# EAGLE schematic BeagleQ-v02 (EAGLE 6.4)
BOARD_NUMBER: 1.0
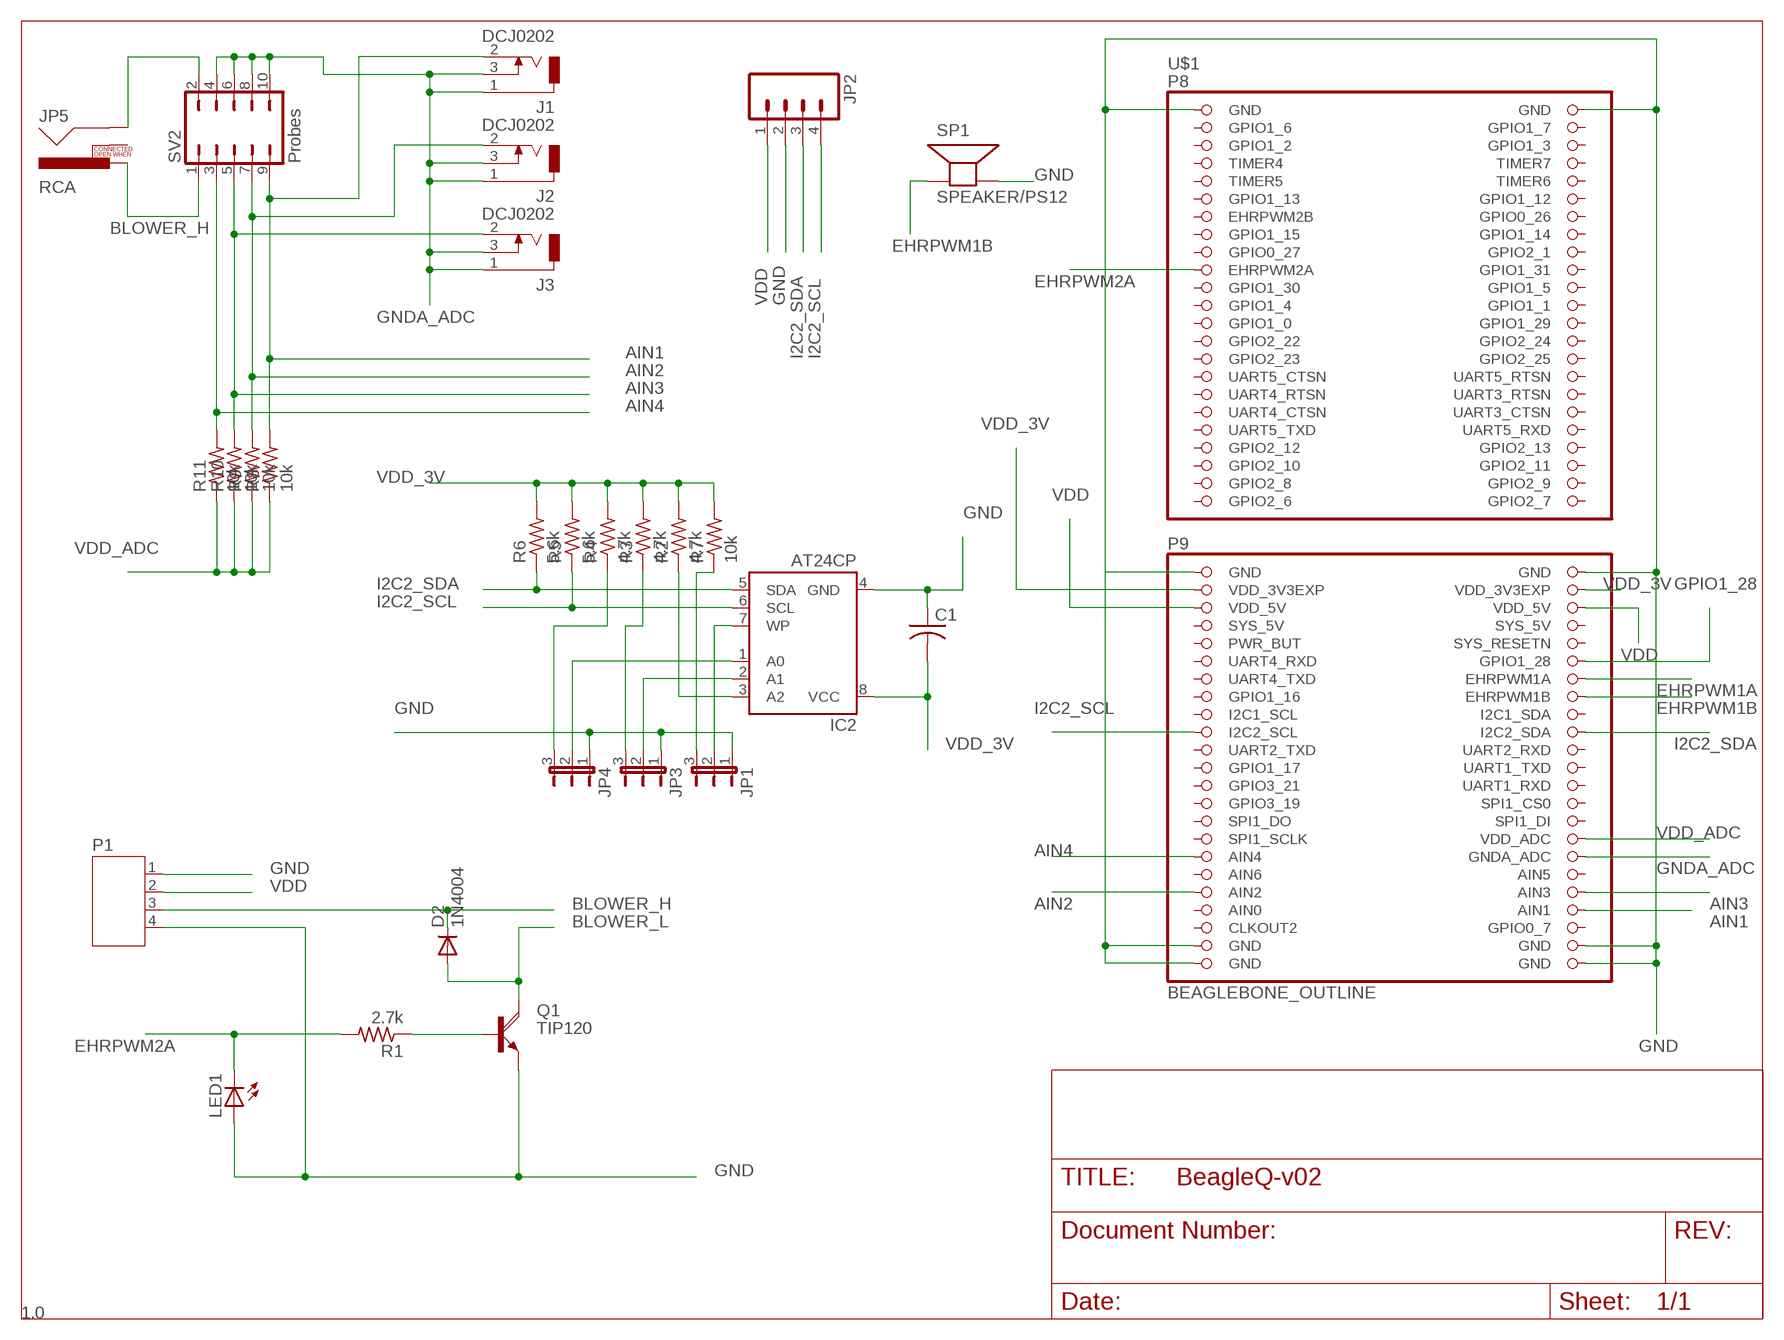
[diagram p0: schematic, sheet 1]
FRAME1 (LETTER_L): BOARD_NUMBER: 1.0

## Parts
C1  C-US025-025X050  [C025-025X050]
D2  1N4004  [DO41-10]
IC2  AT24CP  [DIL08]
J1  DCJ0202  [DCJ0202]
J2  DCJ0202  [DCJ0202]
J3  DCJ0202  [DCJ0202]
JP1  JP2E  [JP2]
JP2  M04PTH  [1X04]
JP3  JP2E  [JP2]
JP4  JP2E  [JP2]
JP5  RCA  [RCA]
LED1  LED3MM  [LED3MM]
P1  JST-PH4  [JST-PH4]
Q1  TIP120  [TO220AH]
R1  2.7k  R-US_0207/10  [0207/10]
R2  4.7k  R-US_0207/10  [0207/10]
R3  4.7k  R-US_0207/10  [0207/10]
R4  4.7k  R-US_0207/10  [0207/10]
R5  5.6k  R-US_0207/10  [0207/10]
R6  5.6k  R-US_0207/10  [0207/10]
R7  10k  R-US_0207/10  [0207/10]
R8  10k  R-US_0207/10  [0207/10]
R9  10k  R-US_0207/10  [0207/10]
R10  10k  R-US_0207/10  [0207/10]
R11  10k  R-US_0207/10  [0207/10]
SP1  SPEAKER/PS12  [PS12]
SV2  Probes  JP5Q  [JP5Q]
U$1  BEAGLEBONE_OUTLINE  [BEAGLEBONE_SHIELD]

## Nets
AIN1: J1.2 R8.2 SV2.9 U$1.86(AIN1)
AIN2: J2.2 R9.2 SV2.7 U$1.83(AIN2)
AIN3: J3.2 R10.2 SV2.5 U$1.84(AIN3)
AIN4: R11.2 SV2.3 U$1.79(AIN4)
BLOWER_H: D2.C JP5.PIN P1.3 SV2.1
BLOWER_L: D2.A JP5.SHELL Q1.C SV2.2
EHRPWM1A: U$1.60(EHRPWM1A)
EHRPWM1B: SP1.P$1(+) U$1.62(EHRPWM1B)
EHRPWM2A: LED1.K(C) R1.2 U$1.19(EHRPWM2A)
GND: C1.1 IC2.4(GND) JP1.1 JP2.2 JP3.1 JP4.1 LED1.A P1.1 P1.4 Q1.E SP1.P$2(-) U$1.1(GND) U$1.2(GND) U$1.47(GND) U$1.48(GND) U$1.89(GND) U$1.90(GND) U$1.91(GND) U$1.92(GND)
GNDA_ADC: J1.1 J1.3 J2.1 J2.3 J3.1 J3.3 SV2.4 SV2.6 SV2.8 SV2.10 U$1.80(GNDA_ADC)
GPIO1_28: U$1.58(GPIO1_28)
I2C2_SCL: IC2.6(SCL) JP2.4 R5.1 U$1.65(I2C2_SCL)
I2C2_SDA: IC2.5(SDA) JP2.3 R6.1 U$1.66(I2C2_SDA)
N$1: IC2.2(A1) JP3.2
N$2: IC2.1(A0) JP4.2
N$3: IC2.7(WP) JP1.2
N$4: Q1.B R1.1
N$5: JP1.3 R7.1
N$6: JP3.3 R3.1
N$7: JP4.3 R4.1
N$9: IC2.3(A2) R2.1
VDD: JP2.1 P1.2 U$1.51(VDD_5V) U$1.52(VDD_5V)
VDD_3V: C1.2 IC2.8(VCC) R2.2 R3.2 R4.2 R5.2 R6.2 R7.2 U$1.49(VDD_3V3EXP) U$1.50(VDD_3V3EXP)
VDD_ADC: R8.1 R9.1 R10.1 R11.1 U$1.78(VDD_ADC)
Unconnected: JP5.SWITCH U$1.3(GPIO1_6) U$1.4(GPIO1_7) U$1.5(GPIO1_2) U$1.6(GPIO1_3) U$1.7(TIMER4) U$1.8(TIMER7) U$1.9(TIMER5) U$1.10(TIMER6) U$1.11(GPIO1_13) U$1.12(GPIO1_12) U$1.13(EHRPWM2B) U$1.14(GPIO0_26) U$1.15(GPIO1_15) U$1.16(GPIO1_14) U$1.17(GPIO0_27) U$1.18(GPIO2_1) U$1.20(GPIO1_31) U$1.21(GPIO1_30) U$1.22(GPIO1_5) U$1.23(GPIO1_4) U$1.24(GPIO1_1) U$1.25(GPIO1_0) U$1.26(GPIO1_29) U$1.27(GPIO2_22) U$1.28(GPIO2_24) U$1.29(GPIO2_23) U$1.30(GPIO2_25) U$1.31(UART5_CTSN) U$1.32(UART5_RTSN) U$1.33(UART4_RTSN) U$1.34(UART3_RTSN) U$1.35(UART4_CTSN) U$1.36(UART3_CTSN) U$1.37(UART5_TXD) U$1.38(UART5_RXD) U$1.39(GPIO2_12) U$1.40(GPIO2_13) U$1.41(GPIO2_10) U$1.42(GPIO2_11) U$1.43(GPIO2_8) U$1.44(GPIO2_9) U$1.45(GPIO2_6) U$1.46(GPIO2_7) U$1.54(SYS_5V) U$1.55(PWR_BUT) U$1.56(SYS_RESETN) U$1.57(UART4_RXD) U$1.59(UART4_TXD) U$1.61(GPIO1_16) U$1.63(I2C1_SCL) U$1.64(I2C1_SDA) U$1.67(UART2_TXD) U$1.68(UART2_RXD) U$1.69(GPIO1_17) U$1.70(UART1_TXD) U$1.71(GPIO3_21) U$1.72(UART1_RXD) U$1.73(GPIO3_19) U$1.74(SPI1_CS0) U$1.75(SPI1_DO) U$1.76(SPI1_DI) U$1.77(SPI1_SCLK) U$1.81(AIN6) U$1.82(AIN5) U$1.87(CLKOUT2) U$1.88(GPIO0_7)

## Power pins joined to a net without a drawn wire
AIN0: U$1.85(AIN0)
SYS_5V: U$1.53(SYS_5V)

## Library data of the parts
C1 = rcl:C-US: CAPACITOR, American symbol
D2 = adafruit:1N4004: DIODE General purpose 1N400x type rectifier (With bigger pads) http://www.ladyada.net/library/pcb/eaglelibrary.html
IC2 = atmel:AT24C*: 2-wire serial EEPROM; MPN: AT24C1024BW-SH-B; OC_FARNELL: 1362646; OC_NEWARK: 03P2044
J1-J3 = houseofbeck:DCJ0202: AUDIO JACK Source: MJ2508.pdf
JP1 JP3 JP4 = jumper:JP2E: JUMPER
JP2 = SparkFun-Connectors:M04: Header 4 Standard 4-pin 0.1" header. Use with straight break away headers (SKU : PRT-00116), right angle break away headers (PRT-00553), swiss pins (PRT-00743), machine pins (PRT-00117), and female headers (PRT-00115). Molex polarized connector foot print use with SKU : PRT-08231 with associated crimp pins and housings. 1MM SMD Version SKU: PRT-10208
JP5 = SparkFun-Connectors:RCA
LED1 = led:LED: LED OSRAM: - CHIPLED LG R971, LG N971, LY N971, LG Q971, LY Q971, LO R971, LY R971 LH N974, LH R974 LS Q976, LO Q976, LY Q976 LO Q996 - Hyper CHIPLED LW Q18S LB Q993, LB Q99A, LB R99A - SideLED LS A670, LO A670, LY A670, LG A670, LP A670 LB A673, LV A673, LT A673, LW A673 LH A674 LY A675 LS A676, LA A676, LO A676, LY A676, LW A676 LS A679, LY A679, LG A679 - Hyper Micro SIDELED® LS Y876, LA Y876, LO Y876, LY Y876 LT Y87S - SmartLED LW L88C, LW L88S LB L89C, LB L89S, LG L890 LS L89K, LO L89K, LY L89K LS L896, LA L896, LO L896, LY L896 - TOPLED LS T670, LO T670, LY T670, LG T670, LP T670 LSG T670, LSP T670, LSY T670, LOP T670, LYG T670 LG T671, LOG T671, LSG T671 LB T673, LV T673, LT T673, LW T673 LH T674 LS T676, LA T676, LO T676, LY T676, LB T676, LH T676, LSB T676, LW T676 LB T67C, LV T67C, LT T67C, LS T67K, LO T67K, LY T67K, LW E67C LS E67B, LA E67B, LO E67B, LY E67B, LB E67C, LV E67C, LT E67C LW T67C LS T679, LY T679, LG T679 LS T770, LO T770, LY T770, LG T770, LP T770 LB T773, LV T773, LT T773, LW T773 LH T774 LS E675, LA E675, LY E675, LS T675 LS T776, LA T776, LO T776, LY T776, LB T776 LHGB T686 LT T68C, LB T68C - Hyper Mini TOPLED® LB M676 - Mini TOPLED Santana® LG M470 LS M47K, LO M47K, LY M47K Source: http://www.osram.convergy.de LUXEON: - LUMILED® LXK2-PW12-R00, LXK2-PW12-S00, LXK2-PW14-U00, LXK2-PW14-V00 LXK2-PM12-R00, LXK2-PM12-S00, LXK2-PM14-U00 LXK2-PE12-Q00, LXK2-PE12-R00, LXK2-PE12-S00, LXK2-PE14-T00, LXK2-PE14-U00 LXK2-PB12-K00, LXK2-PB12-L00, LXK2-PB12-M00, LXK2-PB14-N00, LXK2-PB14-P00, LXK2-PB14-Q00 LXK2-PR12-L00, LXK2-PR12-M00, LXK2-PR14-Q00, LXK2-PR14-R00 LXK2-PD12-Q00, LXK2-PD12-R00, LXK2-PD12-S00 LXK2-PH12-R00, LXK2-PH12-S00 LXK2-PL12-P00, LXK2-PL12-Q00, LXK2-PL12-R00 Source: www.luxeon.com KINGBRIGHT: KA-3528ASYC Source: www.kingbright.com
P1 = jst-ph:JST-PH4
Q1 = transistor-power:TIP120: NPN DARLINGTON TRANSISTOR
R1-R11 = resistor:R-US_: RESISTOR, American symbol
SP1 = adafruit:SPEAKER: SPEAKER Source: Buerklin Added PS12 (for part # PS1240 piezo) http://www.ladyada.net/library/pcb/eaglelibrary.html
SV2 = jumper:JP5Q: JUMPER
U$1 = adafruit:BEAGLEBONE_OUTLINE: Should match A3 pinout - but not completely tested